# EAGLE schematic Maduino Zero Canbus RS485 v1.1 (EAGLE 6.1)
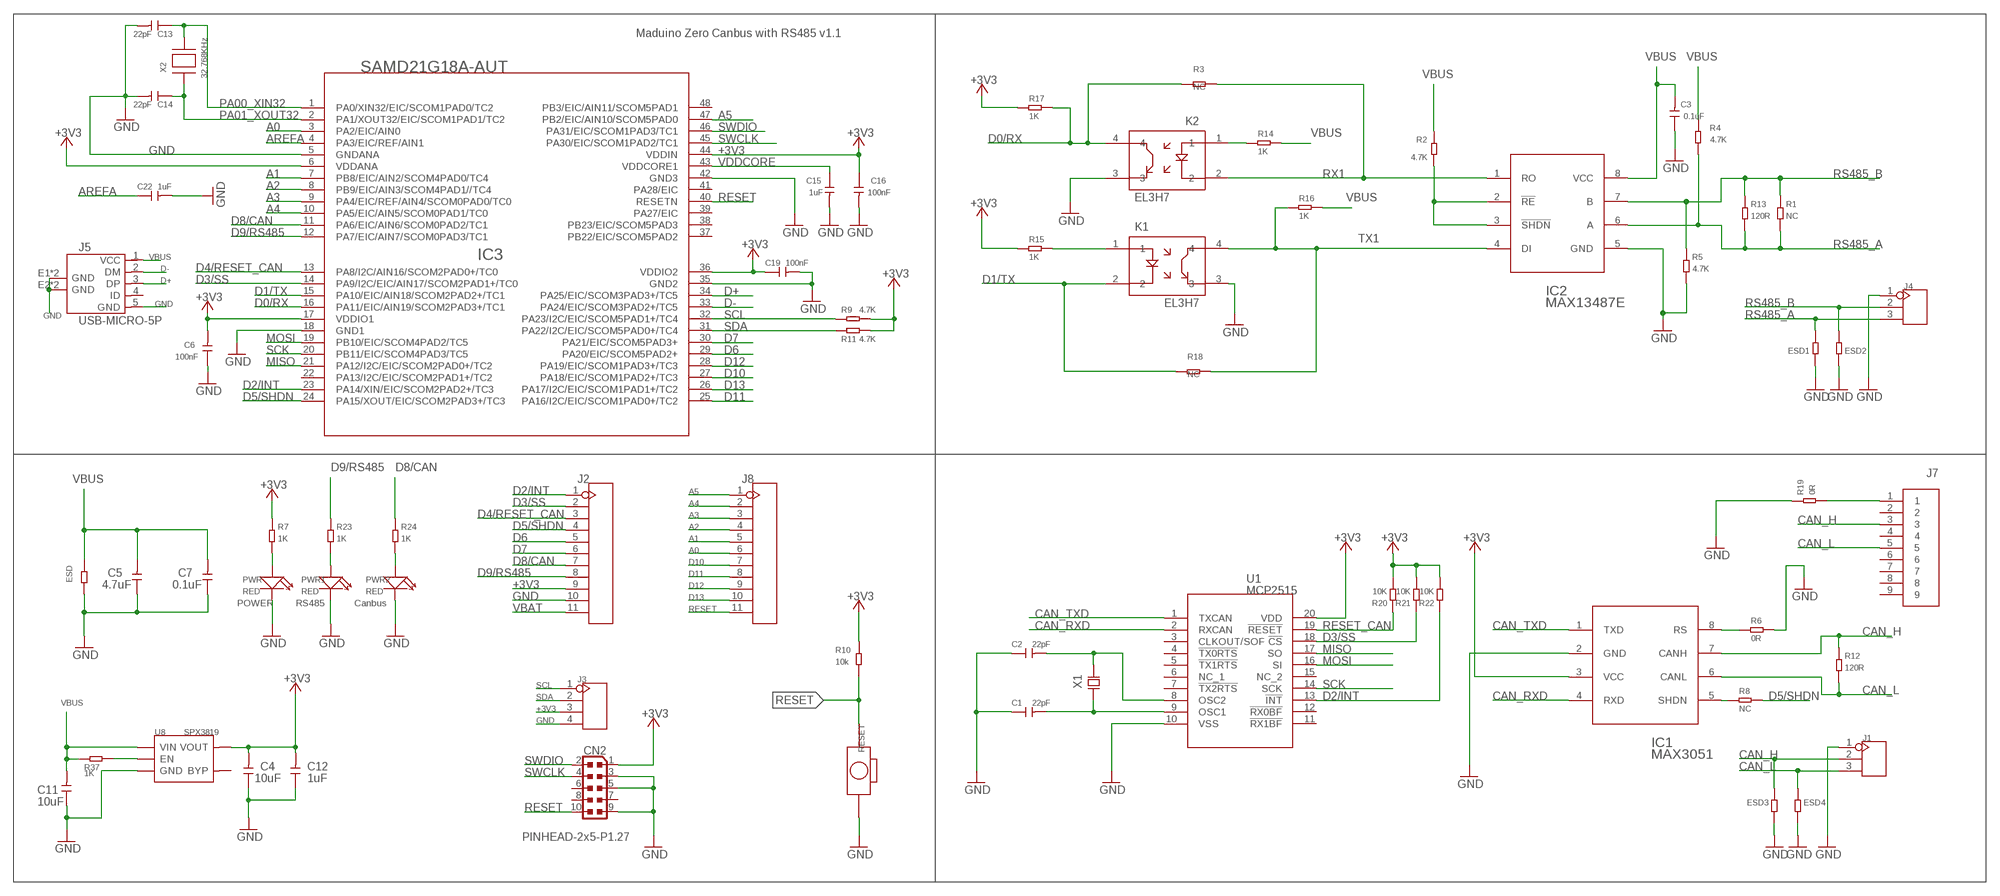
[diagram p0: schematic, sheet 1]

## Parts
C1  22pF  C-0603  [0603]
C2  22pF  C-0603  [0603]
C3  0.1uF  C-0603  [0603]
C4  10uF  C-0603  [0603]
C5  4.7uF  C-0603  [0603]
C6  100nF  C-0603  [0603]
C7  0.1uF  C-0603  [0603]
C11  10uF  C-0603  [0603]
C12  1uF  C-0603  [0603]
C13  22pF  C-0603  [0603]
C14  22pF  C-0603  [0603]
C15  1uF  C-0603  [0603]
C16  100nF  C-0603  [0603]
C19  100nF  C-0603  [0603]
C22  1uF  C-0603  [0603]
CN2  PINHEAD-2x5-P1.27  0171_PH127-205DF055G00AROUND-PADS  [PINHEAD_2X05_127]
ESD  R-0603  [R0603]
ESD1  R-0603  [R0603]
ESD2  R-0603  [R0603]
ESD3  NC  R-0603  [R0603]
ESD4  NC  R-0603  [R0603]
IC1  MAX3051  [DIP8_MX3051]
IC2  MAX13487E  [DIP8_MAX13487]
IC3  SAMD21G18A-AUT  ATSAMD21G18A-AUT  [TQFP48-7X7]
J1  HEADER-3P-2.54  [3P-2.54]
J2  HEADER-11P-2.54  [11P-2.54]
J3  HEADER-4P-60/35MILROUND  [4P-65/35ROUND]
J4  HEADER-3P-2.54  [3P-2.54]
J5  USB-MICRO-5P  [MICRO-USB-5P]
J7  DB9-90  [DIP9-DB9-P2.77]
J8  HEADER-11P-2.54  [11P-2.54]
K1  EL3H7  [SOP-4_P1.27]
K2  EL3H7  [SOP-4_P1.27]
PWR  RED  LED'0603'  [LED-0603]
PWR1  RED  LED'0603'  [LED-0603]
PWR2  RED  LED'0603'  [LED-0603]
R1  NC  R-0603  [R0603]
R2  4.7K  R-0603  [R0603]
R3  NC  R-0603  [R0603]
R4  4.7K  R-0603  [R0603]
R5  4.7K  R-0603  [R0603]
R6  0R  R-0603  [R0603]
R7  1K  R-0603  [R0603]
R8  NC  R-0603  [R0603]
R9  4.7K  R-0603  [R0603]
R10  10k  R-0603  [R0603]
R11  4.7K  R-0603  [R0603]
R12  120R  R-0603  [R0603]
R13  120R  R-0603  [R0603]
R14  1K  R-0603  [R0603]
R15  1K  R-0603  [R0603]
R16  1K  R-0603  [R0603]
R17  1K  R-0603  [R0603]
R18  NC  R-0603  [R0603]
R19  0R  R-0603  [R0603]
R20  10K  R-0603  [R0603]
R21  10K  R-0603  [R0603]
R22  10K  R-0603  [R0603]
R23  1K  R-0603  [R0603]
R24  1K  R-0603  [R0603]
R37  1K  R-0603  [R0603]
RESET  BOTTON-2P-90D  [2P-7.62X3.56-90D]
U1  MCP2515  [SSOP-20]
U8  SPX3819  [SOT23-5]
X1  XTAL-8MHZ  [SMD-5032_2P_8M]
X2  32.768KHz  XTAL-3.2X1.5  [XTAL3215]

## Nets
+3V3: C4.2 C6.2 C12.2 C16.1 C19.1 CN2.1 IC1.3(VCC) IC3.6(VDDANA) IC3.17(VDDIO1) IC3.36(VDDIO2) IC3.44(VDDIN) J2.9 J3.3 R7.1 R9.2 R10.2 R11.2 R15.2 R17.2 R20.1 R21.1 R22.1 U1.20(VDD) U8.5(VOUT)
A0: IC3.3(PA2/EIC/AIN0) J8.6
A1: IC3.7(PB8/EIC/AIN2/SCOM4PAD0/TC4) J8.5
A2: IC3.8(PB9/EIC/AIN3/SCOM4PAD1//TC4) J8.4
A3: IC3.9(PA4/EIC/REF/AIN4/SCOM0PAD0/TC0) J8.3
A4: IC3.10(PA5/EIC/AIN5/SCOM0PAD1/TC0) J8.2
A5: IC3.47(PB2/EIC/AIN10/SCOM5PAD0) J8.1
AREFA: C22.1 IC3.4(PA3/EIC/REF/AIN1)
CAN_H: ESD3.1 IC1.7(CANH) J1.2 J7.3 R12.1
CAN_L: ESD4.1 IC1.6(CANL) J1.3 J7.5 R12.2
CAN_RXD: IC1.4(RXD) U1.2(RXCAN)
CAN_TXD: IC1.1(TXD) U1.1(TXCAN)
D0/RX: IC3.16(PA11/EIC/AIN19/SCOM2PAD3+/TC1) K2.4 R3.2 R17.1
D1/TX: IC3.15(PA10/EIC/AIN18/SCOM2PAD2+/TC1) K1.2 R18.2
D2/INT: IC3.23(PA14/XIN/EIC/SCOM2PAD2+/TC3) J2.1 R22.2 U1.13(!INT)
D3/SS: IC3.14(PA9/I2C/EIC/AIN17/SCOM2PAD1+/TC0) J2.2 R21.2 U1.18(!CS)
D4/RESET_CAN: IC3.13(PA8/I2C/AIN16/SCOM2PAD0+/TC0) J2.3
D5/SHDN: IC3.24(PA15/XOUT/EIC/SCOM2PAD3+/TC3) J2.4 R8.1
D6: IC3.29(PA20/EIC/SCOM5PAD2+) J2.5
D7: IC3.30(PA21/EIC/SCOM5PAD3+) J2.6
D8/CAN: IC3.11(PA6/EIC/AIN6/SCOM0PAD2/TC1) J2.7 R24.1
D9/RS485: IC3.12(PA7/EIC/AIN7/SCOM0PAD3/TC1) J2.8 R23.1
D10: IC3.27(PA18/EIC/SCOM1PAD2+/TC3) J8.7
D11: IC3.25(PA16/I2C/EIC/SCOM1PAD0+/TC2) J8.8
D12: IC3.28(PA19/EIC/SCOM1PAD3+/TC3) J8.9
D13: IC3.26(PA17/I2C/EIC/SCOM1PAD1+/TC2) J8.10
D+: IC3.34(PA25/EIC/SCOM3PAD3+/TC5) J5.3(DP)
D-: IC3.33(PA24/EIC/SCOM3PAD2+/TC5) J5.2(DM)
GND: C1.1 C2.1 C3.1 C4.1 C5.1 C6.1 C7.1 C11.1 C12.1 C13.2 C14.2 C15.2 C16.2 C19.2 C22.2 CN2.3 CN2.5 CN2.9 ESD1.1 ESD2.1 ESD3.2 ESD4.2 ESD.2 IC1.2(GND) IC2.5(GND) IC3.5(GNDANA) IC3.18(GND1) IC3.35(GND2) IC3.42(GND3) J1.1 J2.10 J3.4 J4.1 J5.5(GND) J5.E1(GND) J5.E2(GND) J5.P1(GND) J5.P2(GND) K1.3 K2.3 PWR1.- PWR2.- PWR.- R5.1 R6.1 R19.2 RESET.P$2 U1.10(VSS) U8.2(GND)
MISO: IC3.21(PA12/I2C/EIC/SCOM2PAD0+/TC2) U1.17(SO)
MOSI: IC3.19(PB10/EIC/SCOM4PAD2/TC5) U1.16(SI)
N$1: K2.1 R14.2
N$3: PWR.+ R7.2
N$4: C2.2 U1.8(OSC2) X1.2
N$5: C1.2 U1.9(OSC1) X1.1
N$6: K1.1 R15.1
N$7: J7.1 R19.1
N$8: PWR1.+ R23.2
N$9: PWR2.+ R24.2
N$18: IC1.8(RS) R6.2
N$21: IC1.5(SHDN) R8.2
N$24: R37.2 U8.3(EN)
N$36: IC2.2(!RE) IC2.3(!SHDN) R2.1
PA00_XIN32: C13.1 IC3.1(PA0/XIN32/EIC/SCOM1PAD0/TC2) X2.P$2
PA01_XOUT32: C14.1 IC3.2(PA1/XOUT32/EIC/SCOM1PAD1/TC2) X2.P$1
RESET: CN2.10 IC3.40(RESETN) J8.11 R10.1 RESET.P$1
RESET_CAN: R20.2 U1.19(!RESET)
RS485_A: ESD1.2 IC2.6(A) J4.3 R1.1 R4.1 R13.1
RS485_B: ESD2.2 IC2.7(B) J4.2 R1.2 R5.2 R13.2
RX1: IC2.1(RO) K2.2 R3.1
SCK: IC3.20(PB11/EIC/SCOM4PAD3/TC5) U1.14(SCK)
SCL: IC3.32(PA23/I2C/EIC/SCOM5PAD1+/TC4) J3.1 R9.1
SDA: IC3.31(PA22/I2C/EIC/SCOM5PAD0+/TC4) J3.2 R11.1
SWCLK: CN2.4 IC3.45(PA30/EIC/SCOM1PAD2/TC1)
SWDIO: CN2.2 IC3.46(PA31/EIC/SCOM1PAD3/TC1)
TX1: IC2.4(DI) K1.4 R16.2 R18.1
VBAT: J2.11
VBUS: C3.2 C5.2 C7.2 C11.2 ESD.1 IC2.8(VCC) J5.1(VCC) R2.2 R4.2 R14.1 R16.1 R37.1 U8.1(VIN)
VDDCORE: C15.1 IC3.43(VDDCORE1)
Unconnected: CN2.6 CN2.7 CN2.8 IC3.22(PA13/I2C/EIC/SCOM2PAD1+/TC2) IC3.37(PB22/EIC/SCOM5PAD2) IC3.38(PB23/EIC/SCOM5PAD3) IC3.39(PA27/EIC) IC3.41(PA28/EIC) IC3.48(PB3/EIC/AIN11/SCOM5PAD1) J5.4(ID) J7.2 J7.4 J7.6 J7.7 J7.8 J7.9 U1.3(CLKOUT/SOF) U1.4(!TX0RTS) U1.5(!TX1RTS) U1.6(NC_1) U1.7(!TX2RTS) U1.11(!RX1BF) U1.12(!RX0BF) U1.15(NC_2) U8.4(BYP)

## Notes on the sheet
- Maduino Zero Canbus with RS485 v1.1
- POWER | RS485 | Canbus

## Library data of the parts
C1-C7 C11-C16 C19 C22 = Discrete:C*: Ceramic Capacitors
CN2 = Connettori:0171_PH127-205DF055G00A: 2x5 PASSO 1,27
ESD ESD1-ESD4 R1-R24 R37 = Discrete:R*
IC1 = 1mytest:MAX3051
IC2 = 1mytest:MAX13487E
IC3 = IC:ATSAMD21G18A-AUT: Atmel D21 32bit ARM Cortex-M0 microcontroller - 48 PIN TQFP 256KB flash memory + 32KB SRAM
J1 J4 = Connector:HEADER-3P
J2 J8 = Connector:HEADER-11P
J3 = Connector:HEADER-4P
J5 = Connector:USB-MICRO-5P
J7 = 1mytest:DB9-90
K1 K2 = 1mytest:EL3H7: Optocoupler
PWR PWR1 PWR2 = Discrete:LED*
RESET = Discrete:BOTTON-2P
U1 = 1mytest:MCP2515
U8 = IC:SPX3819
X1 = 1mytest:XTAL-8MHZ
X2 = adafruit2:XTAL: Low cost SMT crystals, no capacitors included http://www.ladyada.net/library/eagle

## Net classes
0 default: clearance 0.152 mm
2 gnd: width 0.305 mm, drill 0.559 mm, clearance 0.254 mm
3 usbvcc: width 0.508 mm, drill 0.61 mm, clearance 0.254 mm
4 USBpair: width 0.254 mm, drill 0.406 mm, clearance 0.406 mm